# Altium schematic sheet Comm_Interface.SchDoc
size A4
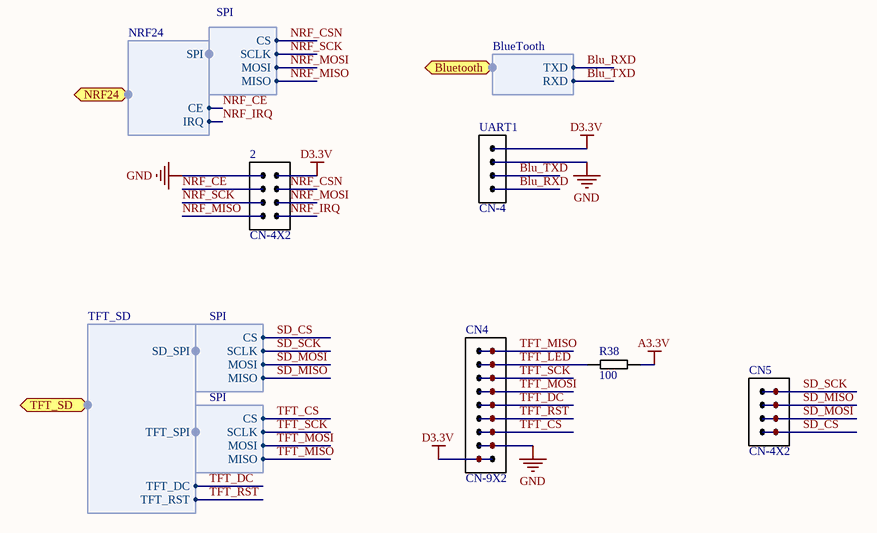
[diagram p0: Comm_Interface.SchDoc]

## Parts
2  CN-4X2  [IDC-8]
CN4  CN-9X2  [IDC-18]
CN5  CN-4X2  [IDC-8]
R38  100  [0805-R]
UART1  CN-4  [SIP-4]

## Ports
Bluetooth (harness BlueTooth), NRF24 (harness NRF24), TFT_SD (harness TFT_SD)

## Harnesses
NRF24: SPI, CE, IRQ
SPI: CS, SCLK, MOSI, MISO
BlueTooth: TXD, RXD
TFT_SD: SD_SPI, TFT_SPI, TFT_DC, TFT_RST

## Nets
A3.3V: R38.2
D3.3V: 2.2 CN4.17 CN4.18 UART1.1
GND: 2.1 CN4.15 CN4.16 UART1.2
Blu_RXD: UART1.4 ; port Bluetooth.TXD
Blu_TXD: UART1.3 ; port Bluetooth.RXD
NRF_CE: 2.3 ; port NRF24.CE
NRF_CSN: 2.4 ; harness SPI.CS
NRF_IRQ: 2.8 ; port NRF24.IRQ
NRF_MISO: 2.7 ; harness SPI.MISO
NRF_MOSI: 2.6 ; harness SPI.MOSI
NRF_SCK: 2.5 ; harness SPI.SCLK
SD_CS: CN5.7 CN5.8 ; harness SPI.CS
SD_MISO: CN5.3 CN5.4 ; harness SPI.MISO
SD_MOSI: CN5.5 CN5.6 ; harness SPI.MOSI
SD_SCK: CN5.1 CN5.2 ; harness SPI.SCLK
TFT_CS: CN4.13 CN4.14 ; harness SPI.CS
TFT_DC: CN4.9 CN4.10 ; port TFT_SD.TFT_DC
TFT_LED: CN4.3 CN4.4 R38.1
TFT_MISO: CN4.1 CN4.2 ; harness SPI.MISO
TFT_MOSI: CN4.7 CN4.8 ; harness SPI.MOSI
TFT_RST: CN4.11 CN4.12 ; port TFT_SD.TFT_RST
TFT_SCK: CN4.5 CN4.6 ; harness SPI.SCLK

## Library data of the parts
R38 = RES_Chip: 贴片